# Altium schematic sheet [12] WIFI_Module.SchDoc
size B; Organization: Altium Limited; Address1: L3, 12a Rodborough Rd; Address2: Frenchs Forest; Address3: NSW; Address4: Australia 2086
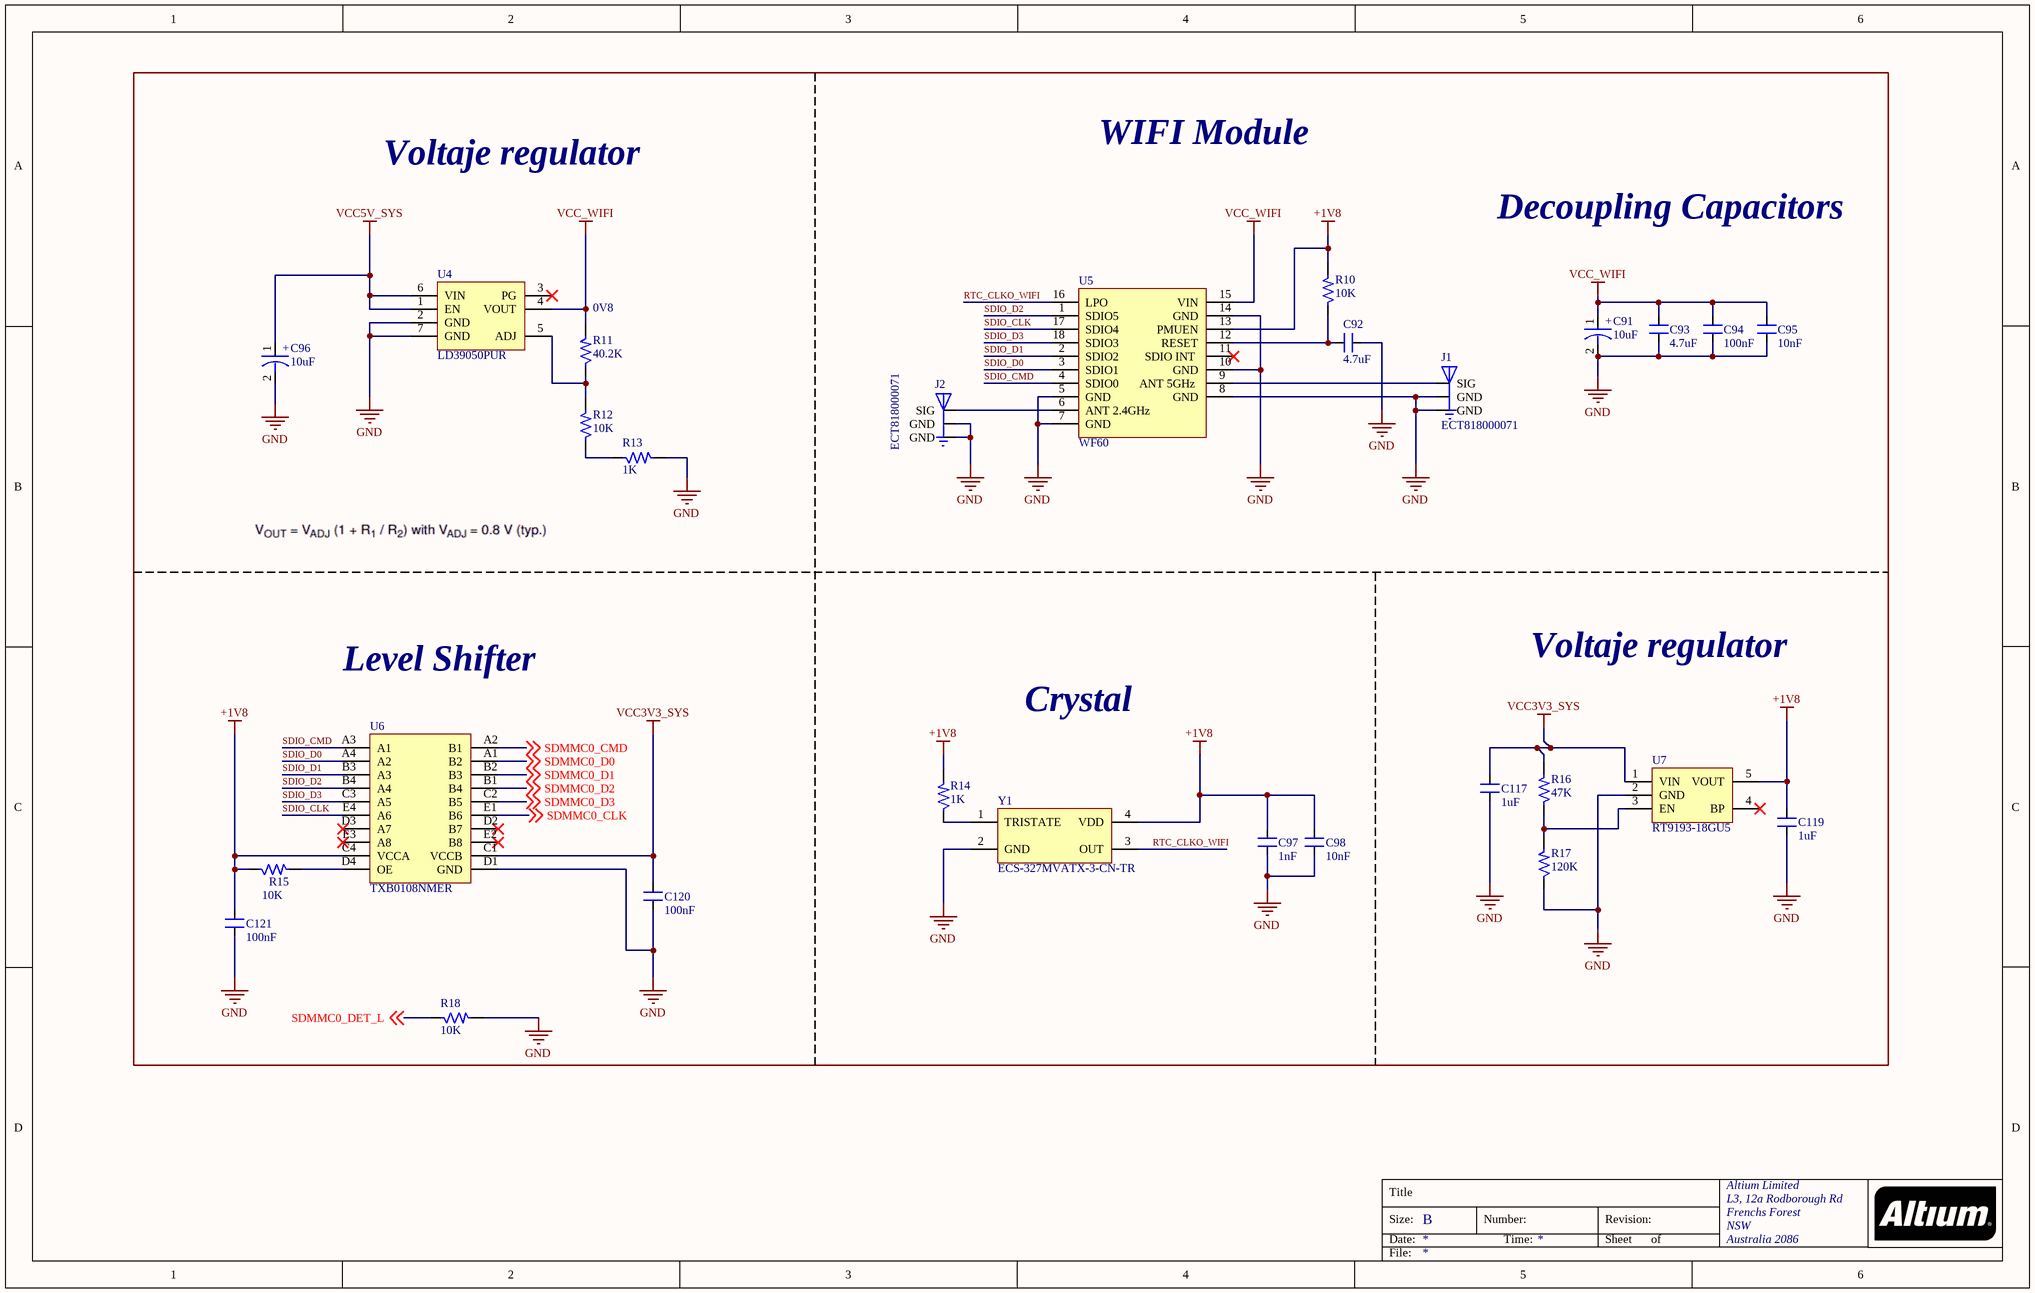
[diagram p0: [12] WIFI_Module.SchDoc]

## Parts
C91  10uF  [CAP-T_1206]
C92  4.7uF  [CAP_0201]
C93  4.7uF  [CAP_0402]
C94  100nF  [CAP_0402]
C95  10nF  [CAP_0402]
C96  10uF  [CAP-T_1206]
C97  1nF  [CAP_0402]
C98  10nF  [CAP_0402]
C117  1uF  [CAP_0201]
C119  1uF  [CAP_0201]
C120  100nF  [CAP_0201]
C121  100nF  [CAP_0201]
J1  ECT818000071  [CON3_UFL_116_SMD_ST]
J2  ECT818000071  [CON3_UFL_116_SMD_ST]
R10  10K  [RES_0201]
R11  40.2K  [RES_0201]
R12  10K  [RES_0201]
R13  1K  [RES_0402]
R14  1K  [RES_0201]
R15  10K  [RES_0201]
R16  47K  [RES_0402]
R17  120K  [RES_0402]
R18  10K  [RES_0201]
U4  LD39050PUR  [DFN-6_37.4_165_33X15_SMD]
U5  WF60  [MOD_WF60]
U6  TXB0108NMER  [NFBGA_31.4_125.9X102.36]
U7  RT9193-18GU5  [SC70-5]
Y1  ECS-327MVATX-3-CN-TR  [XTAL_57_35X31_SMD]

## Nets
+1V8: C97.2 C98.2 C119.2 C121.2 R10.2 R14.2 R15.1 U5.13(PMUEN) U6.C4(VCCA) U7.5(VOUT) Y1.4(VDD)
GND: C91.2 C92.2 C93.1 C94.1 C95.1 C96.2 C97.1 C98.1 C117.1 C119.1 C120.1 C121.1 J1.1(GND) J1.3(GND) J2.1(GND) J2.3(GND) R13.2 R17.1 R18.2 U4.2(GND) U4.7(GND) U5.5(GND) U5.7(GND) U5.8(GND) U5.10(GND) U5.14(GND) U6.D1(GND) U7.2(GND) Y1.2(GND)
VCC3V3_SYS: C117.2 C120.2 R16.2 U6.C1(VCCB) U7.1(VIN)
VCC5V_SYS: C96.1 U4.1(EN) U4.6(VIN)
VCC_WIFI: C91.1 C93.2 C94.2 C95.2 R11.2 U4.4(VOUT) U5.15(VIN)
RTC_CLKO_WIFI: U5.16(LPO) Y1.3(OUT)
SDIO_CLK: U5.17(SDIO4) U6.E4(A6)
SDIO_CMD: U5.4(SDIO0) U6.A3(A1)
SDIO_D0: U5.3(SDIO1) U6.A4(A2)
SDIO_D1: U5.2(SDIO2) U6.B3(A3)
SDIO_D2: U5.1(SDIO5) U6.B4(A4)
SDIO_D3: U5.18(SDIO3) U6.C3(A5)
SDMMC0_CLK: U6.E1(B6) ; off-sheet SDMMC0_CLK
SDMMC0_CMD: U6.A2(B1) ; off-sheet SDMMC0_CMD
SDMMC0_D0: U6.A1(B2) ; off-sheet SDMMC0_D0
SDMMC0_D1: U6.B2(B3) ; off-sheet SDMMC0_D1
SDMMC0_D2: U6.B1(B4) ; off-sheet SDMMC0_D2
SDMMC0_D3: U6.C2(B5) ; off-sheet SDMMC0_D3
SDMMC0_DET_L: R18.1 ; off-sheet SDMMC0_DET_L
NetC92_1: C92.1 R10.1 U5.12(RESET)
NetJ1_2: J1.2(SIG) U5.9(ANT_5GHz)
NetJ2_2: J2.2(SIG) U5.6(ANT_2.4GHz)
NetR11_1: R11.1 R12.2 U4.5(ADJ)
NetR12_1: R12.1 R13.1
NetR14_1: R14.1 Y1.1(TRISTATE)
NetR15_2: R15.2 U6.D4(OE)
NetR16_1: R16.1 R17.2 U7.3(EN)

Not connected (* = marked no-connect by the designer): U4 3(PG)*; U5 11(SDIO_INT_)*; U6 D2(B7)* D3(A7)* E2(B8)* E3(A8)*; U7 4(BP)*

## Notes on the sheet
- WIFI Module
- Voltaje regulator
- Decoupling Capacitors
- (near R11) 0V8
- Level Shifter
- Crystal
- Title
- Size:
- Date:
- B
- Number:
- Time:
- Revision:
- Sheet
- of
- File:
- (in symbol CAP-P_10uF-16V-10%-1206) +

## Library data of the parts
C91 C96 = CAP-P_10uF-16V-10%-1206: 10µF Molded Tantalum Capacitors 16V 1206 (3216 Metric) 3Ohm /; Manufacturer: AVX Corporation; Manufacturer Part Number: TAJA106K016SNJ; Alternate Part Number-1: CA45-A016K106T; Case/Package: 1206; Supplier-1: SIRICOM; Supplier Part Number-1: TAJA106K016SNJ; Category: Capacitor; Number of Pins: 2
C92 = CAP_4.7uF-6.3V-20%-0201: 4.7µF ±20% 6.3V Ceramic Capacitor X5R 0201 (0603 Metric) /; Manufacturer: Murata Electronics; Manufacturer Part Number: GRM035R60J475ME15D; Case/Package: 0201; Supplier-1: Digikey
C93 = CAP_4.7uF-10V-10%-0402: 4.7µF ±10% 10V Ceramic Capacitor X5R 0402 (1005 Metric) /; Manufacturer: Samsung Electro-Mechanics; Manufacturer Part Number: CL05A475KP5NRNC; Case/Package: 0402; Supplier-1: Digikey
C94 = CAP_100nF-25V-10%-0402: 0.1µF ±10% 25V Ceramic Capacitor X7R 0402 (1005 Metric) /; Manufacturer: Walsin Technology Corporation; Manufacturer Part Number: 0402B104K250CT; Case/Package: 0402; Supplier-1: Digikey
C95 C98 = CAP_10nF-10V-10%-0402: 10000pF ±10% 10V Ceramic Capacitor X7R 0402 (1005 Metric) /; Manufacturer: AVX Corporation; Manufacturer Part Number: 0402ZC103KAT2A; Case/Package: 0402; Supplier-1: Digikey
C97 = CAP_1nF-10V-10%-0402: 1000pF ±10% 10V Ceramic Capacitor X7R 0402 (1005 Metric) /; Manufacturer: KEMET; Manufacturer Part Number: C0402C102K8RACTU; Case/Package: 0402; Supplier-1: Digikey
C117 C119 = CAP_1uF-16V-10%-0201: 1µF ±20% 16V Ceramic Capacitor X5R 0201 (0603 Metric) /; Manufacturer: Samsung Electro-Mechanics; Manufacturer Part Number: CL03A105MO3NRNH; Case/Package: 0201; Supplier-1: Digikey
C120 C121 = CAP_100nF-25V-10%-0201: 0.1µF ±10% 25V Ceramic Capacitor X5R 0201 (0603 Metric) /; Manufacturer: TDK Corporation; Manufacturer Part Number: C0603X5R1E104K030BB; Case/Package: 0201; Supplier-1: Digikey
J1 J2 = CON-PLG_3X1-ECT818000071-ST-SMD: SMD RF Connectors/Coaxial Connectors RoHS; Manufacturer: ECT; Manufacturer Part Number: ECT818000071; Case/Package: SMD; Supplier-1: LCSC
R10 R12 R14 R15 R18 = RES_10K-0.05W-1%-0201: 10 kOhms ±1% 0.05W, 1/20W Chip Resistor 0201 (0603 Metric) Thick Film /; Manufacturer: Stackpole Electronics Inc; Manufacturer Part Number: RMCF0201FT10K0; Case/Package: 0201; Supplier-1: Digikey
R11 = RES_40.2K-0.05W-1%-0201: 40.2 kOhms ±1% 0.05W, 1/20W Chip Resistor 0201 (0603 Metric) Automotive AEC-Q200, Moisture Resistant Thick Film /; Manufacturer: Yageo; Manufacturer Part Number: AC0201FR-0740K2L; Case/Package: 0201; Supplier-1: Digikey
R13 = RES_1K-0.1W-1%-0402: 1 kOhms ±1% 0.1W, 1/10W Chip Resistor 0402 (1005 Metric) Anti-Sulfur Thin Film /; Manufacturer: Vishay Beyschlag/Draloric/BC Components; Manufacturer Part Number: MCS04020C1001FE000; Case/Package: 0402; Supplier-1: Digikey
R16 = RES_47K-0.1W-1%-0402: 47 kOhms ±1% 0.1W, 1/10W Chip Resistor 0402 (1005 Metric) Automotive AEC-Q200 Thick Film /; Manufacturer: Panasonic Electronic Components; Manufacturer Part Number: ERJ-2RKF4702X; Case/Package: 0402; Supplier-1: Digikey
R17 = RES_120K-0.1W-1%-0402: 120 kOhms ±1% 0.1W, 1/10W Chip Resistor 0402 (1005 Metric) Anti-Sulfur Thin Film /; Manufacturer: Vishay Beyschlag/Draloric/BC Components; Manufacturer Part Number: MCS04020C1203FE000; Case/Package: 0402; Supplier-1: Digikey
U4 = REG_5.5V-0~5.1V-0.5A-2.55W-DFN-6: Adjustable 5.5V 0.8V 500mA DFN-6 Linear Voltage Regulators RoHS; Manufacturer: STMicroelectronics; Alternate Part Number-1: NA; Manufacturer Part Number: LD39050PUR; Case/Package: DFN-6; Supplier-1: LCSC; Supplier Part Number-1: C222094; Category: Regulators; Number of Pins: 6
U5 = MOD_WF60-SMD: Amp’ed RF Tech presents the WF60 WiFi dual / band module: 802.11abgn.; Alternate Part Number-1: NA; Manufacturer: Amp’ed; Manufacturer Part Number: WF60; Case/Package: SMD; Supplier-1: Arrow; Supplier Part Number-1: WF60; Category: Module; Number of Pins: 16
U6 = IC_TXB0108NMER: Translation - Voltage Levels 8-Bit Bidirectional Voltage-Level Shifter with Auto Direction Sensing and +/-15-kV ESD Protect; Manufacturer: Texas Instruments; Manufacturer Part Number: TXB0108NMER; Case/Package: NFBGA-20; Supplier-1: Mouser
U7 = REG_1.8V-300mA-5.5V-SC70-5: Linear Voltage Regulator IC 1 Output 300mA SC-70-5; Manufacturer: Richtek USA Inc.; Manufacturer Part Number: RT9193-18GU5; Case/Package: SC70-5; Supplier-1: Digikey
Y1 = XTAL_ECS-327MVATX-2-CN-TR: 32.768kHz XO (Standard) CMOS Oscillator 1.6V ~ 3.6V Enable/Disable 4-SMD, No Lead; Manufacturer: ECS INC; Alternate Part Number-1: NA; Manufacturer Part Number: ECS-327MVATX-3-CN-TR; Case/Package: SMD-4; Supplier-1: Digikey; Supplier Part Number-1: ECS-327MVATX-3-CN-TR; Category: Crystal; Number of Pins: 4